# EAGLE design snowflake-r2 (EAGLE 5.12)
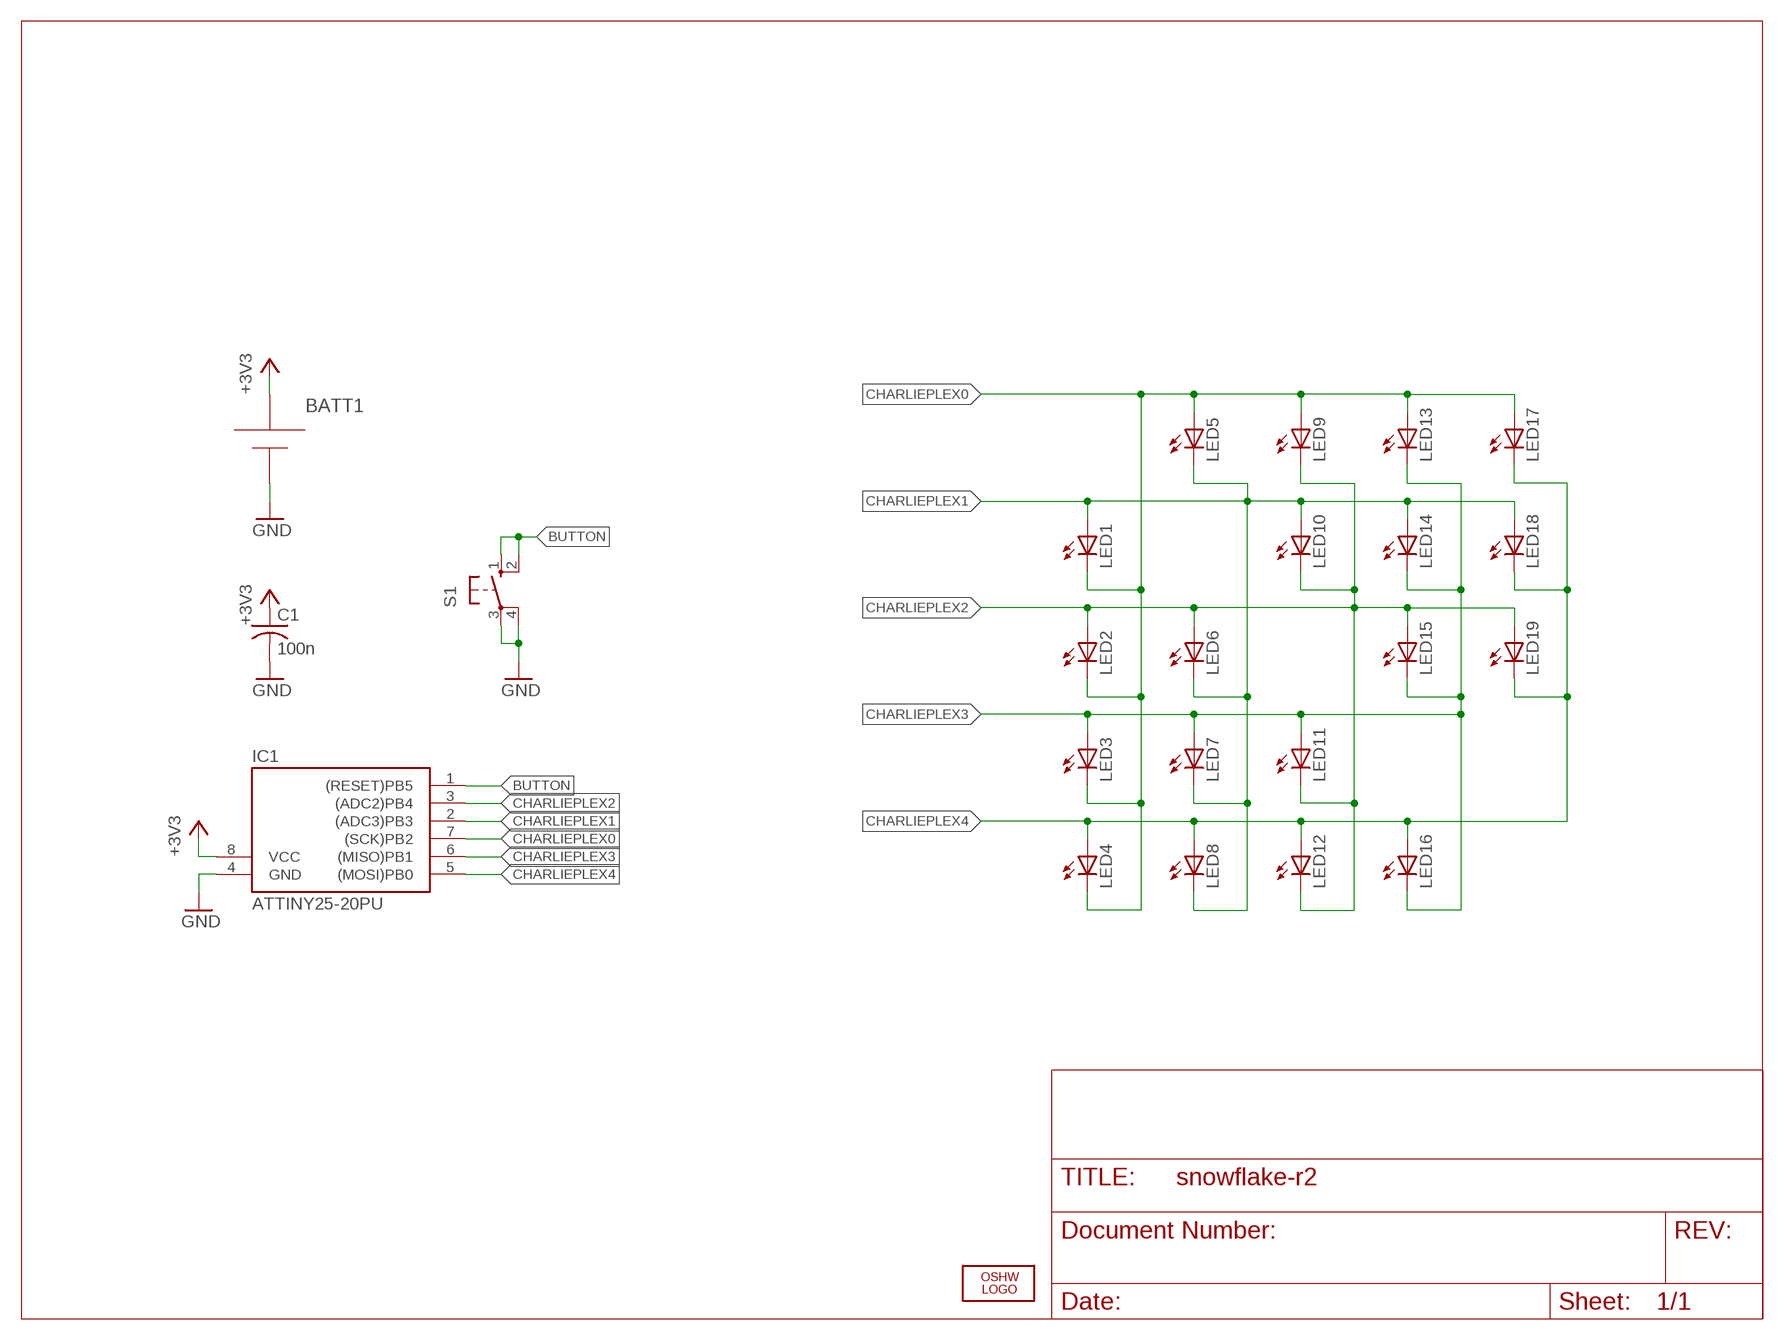
[diagram p0: schematic, sheet 1]

## Parts
BATT1  BC2AAAPC-CHINA  [BC2AAAPC-CHINA]
C1  100n  C-US050-025X075  [C050-025X075]
IC1  ATTINY25-20PU  TINY138P3  [DIL08]
LED1  LED3MM  [LED3MM]
LED2  LED3MM  [LED3MM]
LED3  LED3MM  [LED3MM]
LED4  LED3MM  [LED3MM]
LED5  LED3MM  [LED3MM]
LED6  LED3MM  [LED3MM]
LED7  LED3MM  [LED3MM]
LED8  LED3MM  [LED3MM]
LED9  LED3MM  [LED3MM]
LED10  LED3MM  [LED3MM]
LED11  LED3MM  [LED3MM]
LED12  LED3MM  [LED3MM]
LED13  LED3MM  [LED3MM]
LED14  LED3MM  [LED3MM]
LED15  LED3MM  [LED3MM]
LED16  LED3MM  [LED3MM]
LED17  LED3MM  [LED3MM]
LED18  LED3MM  [LED3MM]
LED19  LED3MM  [LED3MM]
LOGO1  OSHW_LOGO_FILLX0100-NT  [OSHW_FILLX100_NOTEXT]
S1  10-XX  [B3F-10XX]

## Nets
+3V3: BATT1.+ C1.1 IC1.8(VCC)
BUTTON: IC1.1((RESET)PB5) S1.1(S) S1.2(S1)
CHARLIEPLEX0: IC1.7((SCK)PB2) LED1.K(C) LED2.K(C) LED3.K(C) LED4.K(C) LED5.A LED9.A LED13.A LED17.A
CHARLIEPLEX1: IC1.2((ADC3)PB3) LED1.A LED5.K(C) LED6.K(C) LED7.K(C) LED8.K(C) LED10.A LED14.A LED18.A
CHARLIEPLEX2: IC1.3((ADC2)PB4) LED2.A LED6.A LED9.K(C) LED10.K(C) LED11.K(C) LED12.K(C) LED15.A LED19.A
CHARLIEPLEX3: IC1.6((MISO)PB1) LED3.A LED7.A LED11.A LED13.K(C) LED14.K(C) LED15.K(C) LED16.K(C)
CHARLIEPLEX4: IC1.5((MOSI)PB0) LED4.A LED8.A LED12.A LED16.A LED17.K(C) LED18.K(C) LED19.K(C)
GND: BATT1.- C1.2 IC1.4(GND) S1.3(P) S1.4(P1)

## Library data of the parts
BATT1 = rbg-mpd-battholder:BC2AAAPC-CHINA
C1 = rcl:C-US: CAPACITOR, American symbol
IC1 = avr-5:TINY13*
LED1-LED19 = led:LED: LED OSRAM: - CHIPLED LG R971, LG N971, LY N971, LG Q971, LY Q971, LO R971, LY R971 LH N974, LH R974 LS Q976, LO Q976, LY Q976 LO Q996 - Hyper CHIPLED LW Q18S LB Q993, LB Q99A, LB R99A - SideLED LS A670, LO A670, LY A670, LG A670, LP A670 LB A673, LV A673, LT A673, LW A673 LH A674 LY A675 LS A676, LA A676, LO A676, LY A676, LW A676 LS A679, LY A679, LG A679 - Hyper Micro SIDELED® LS Y876, LA Y876, LO Y876, LY Y876 LT Y87S - SmartLED LW L88C, LW L88S LB L89C, LB L89S, LG L890 LS L89K, LO L89K, LY L89K LS L896, LA L896, LO L896, LY L896 - TOPLED LS T670, LO T670, LY T670, LG T670, LP T670 LSG T670, LSP T670, LSY T670, LOP T670, LYG T670 LG T671, LOG T671, LSG T671 LB T673, LV T673, LT T673, LW T673 LH T674 LS T676, LA T676, LO T676, LY T676, LB T676, LH T676, LSB T676, LW T676 LB T67C, LV T67C, LT T67C, LS T67K, LO T67K, LY T67K, LW E67C LS E67B, LA E67B, LO E67B, LY E67B, LB E67C, LV E67C, LT E67C LW T67C LS T679, LY T679, LG T679 LS T770, LO T770, LY T770, LG T770, LP T770 LB T773, LV T773, LT T773, LW T773 LH T774 LS E675, LA E675, LY E675, LS T675 LS T776, LA T776, LO T776, LY T776, LB T776 LHGB T686 LT T68C, LB T68C - Hyper Mini TOPLED® LB M676 - Mini TOPLED Santana® LG M470 LS M47K, LO M47K, LY M47K Source: http://www.osram.convergy.de LUXEON: - LUMILED® LXK2-PW12-R00, LXK2-PW12-S00, LXK2-PW14-U00, LXK2-PW14-V00 LXK2-PM12-R00, LXK2-PM12-S00, LXK2-PM14-U00 LXK2-PE12-Q00, LXK2-PE12-R00, LXK2-PE12-S00, LXK2-PE14-T00, LXK2-PE14-U00 LXK2-PB12-K00, LXK2-PB12-L00, LXK2-PB12-M00, LXK2-PB14-N00, LXK2-PB14-P00, LXK2-PB14-Q00 LXK2-PR12-L00, LXK2-PR12-M00, LXK2-PR14-Q00, LXK2-PR14-R00 LXK2-PD12-Q00, LXK2-PD12-R00, LXK2-PD12-S00 LXK2-PH12-R00, LXK2-PH12-S00 LXK2-PL12-P00, LXK2-PL12-Q00, LXK2-PL12-R00 Source: www.luxeon.com KINGBRIGHT: KA-3528ASYC Source: www.kingbright.com
LOGO1 = ohw-logo:OSHW_LOGO_FILL
S1 = rbg-generic-tact-switch:10-XX: OMRON SWITCH

## Board
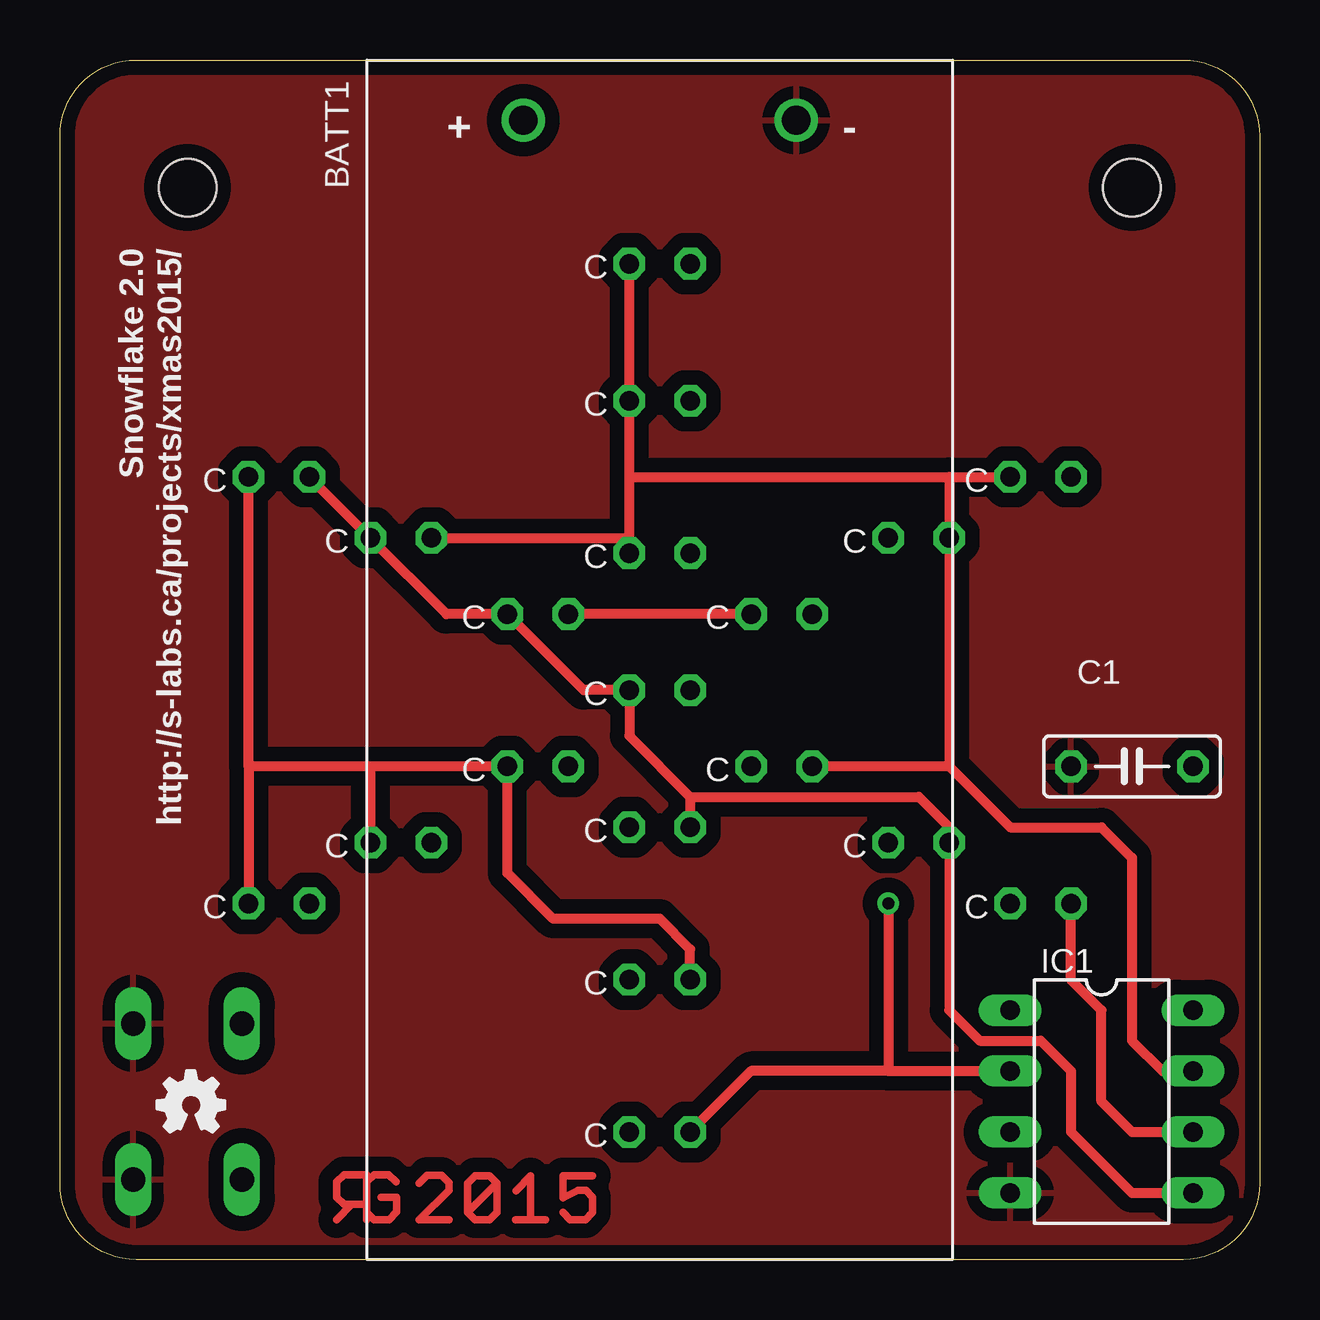
[diagram p1: board, top side]
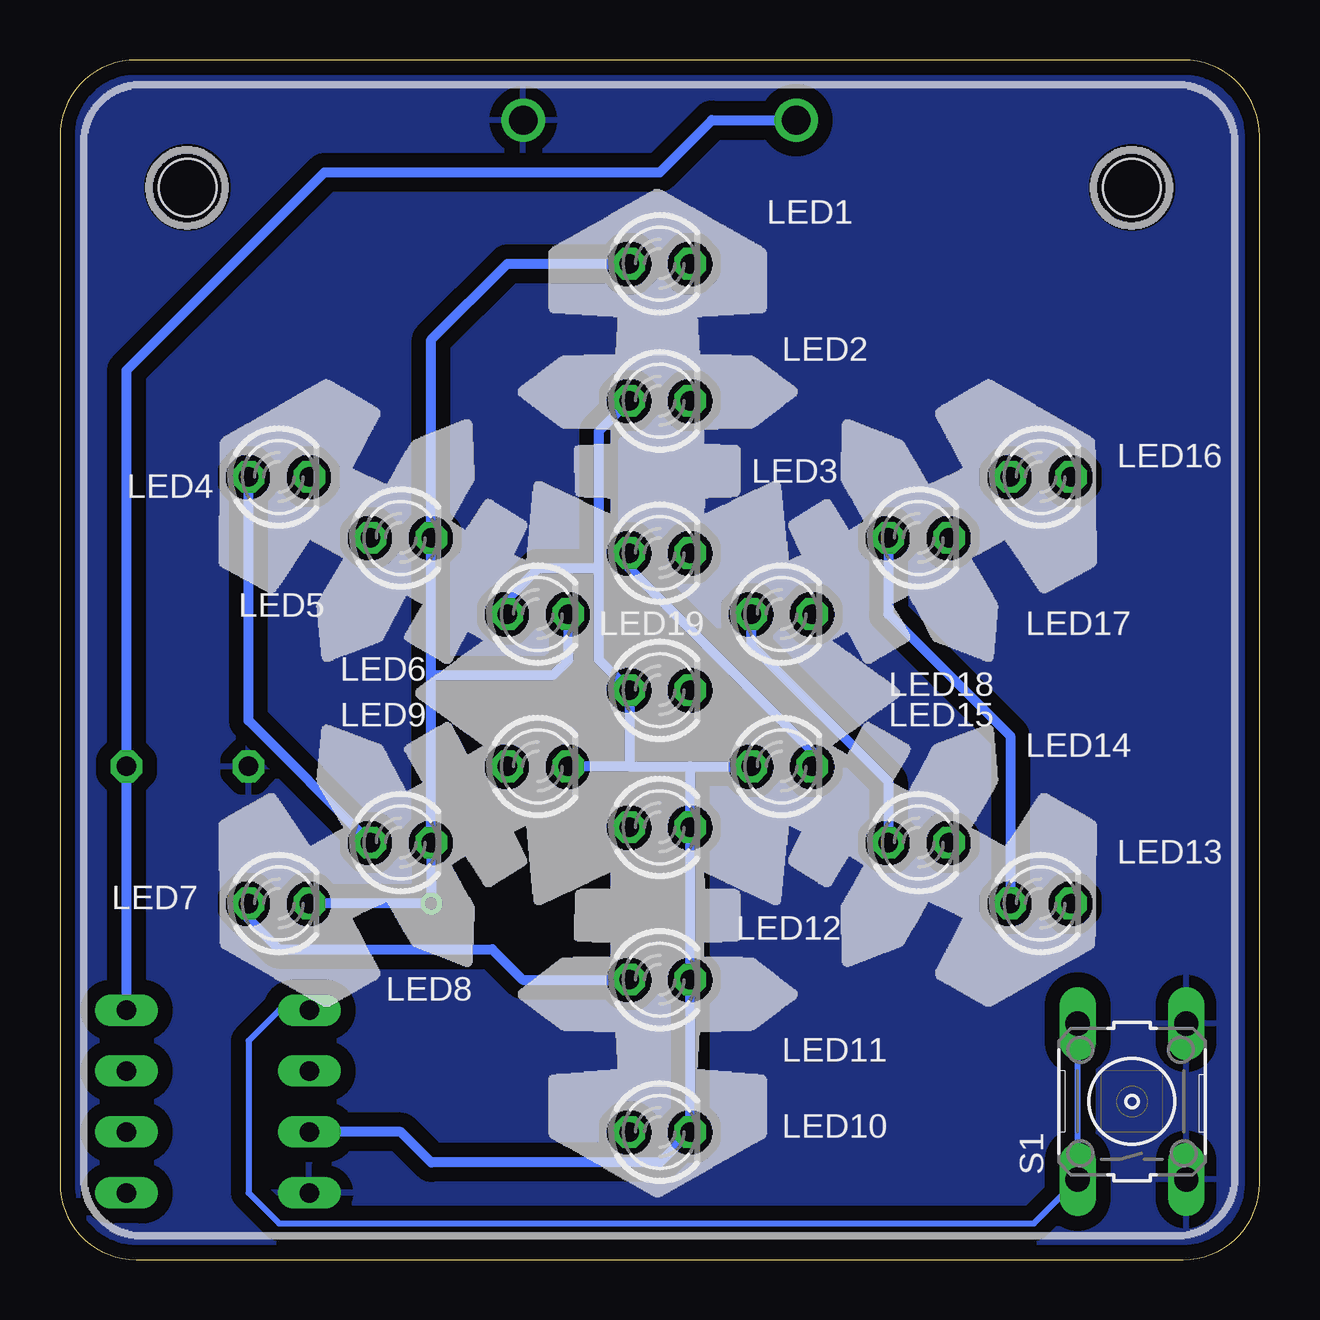
[diagram p2: board, bottom side, seen from below]

Size 50 x 50 mm. Coordinates in mm from the lower left corner, seen from the top.
Outline: 50,3.18 arc-90 46.83,0 3.18,0 arc-90 0,3.18 0,46.83 arc-90 3.18,50 46.83,50 arc-90 50,46.83 50,3.18
Copper layers (1*16): Top 0.035mm / dielectric 1.5mm / Bottom 0.035mm
Design rules "default *": minimum track width 10mil, minimum drill 0.5mm, track to track 8mil, track to pad 8mil, pad to pad 8mil, via to via 8mil, smd to smd 8mil, copper to edge 10mil, drill to drill 8mil, minimum pad ring 10mil, minimum via ring 8mil, stop-mask expansion 4mil, vias tented up to drill 20mil, thermal gap 20mil
Holes 2.4 mm at 44.69,44.69 5.32,44.69

### Footprints (pad centres in the part's own frame; a part is rotated, then mirrored left to right if it is on the bottom)
BC2AAAPC-CHINA = drill 1.2 round: + -22.49,-5.69; - -22.49,5.69
C050-025X075 = drill 0.813 octagon: 1 -2.54,0; 2 2.54,0
DIL08 = drill 0.813 long: 1 -3.81,-3.81; 2 -1.27,-3.81; 3 1.27,-3.81; 4 3.81,-3.81; 5 3.81,3.81; 6 1.27,3.81; 7 -1.27,3.81; 8 -3.81,3.81
LED3MM = drill 0.813 octagon: A -1.27,0; K 1.27,0
B3F-10XX = drill 1.016 long: 1 -3.251,2.261; 2 3.251,2.261; 3 -3.251,-2.261; 4 3.251,-2.261

### Placement (x,y rotation side)
BATT1  25,25 270 top
C1  44.69,20.55 180 top
IC1  43.41,6.59 270 top
LED1  25,41.51 0 bottom
LED2  25,35.8 0 bottom
LED3  25,29.45 0 bottom
LED4  40.88,32.62 0 bottom
LED5  35.8,30.08 0 bottom
LED6  30.08,26.91 0 bottom
LED7  40.88,14.84 0 bottom
LED8  35.8,17.38 0 bottom
LED9  30.08,20.55 0 bottom
LED10  25,5.32 0 bottom
LED11  25,11.66 0 bottom
LED12  25,18.02 0 bottom
LED13  9.12,14.84 0 bottom
LED14  14.21,17.38 0 bottom
LED15  19.92,20.55 0 bottom
LED16  9.12,32.62 0 bottom
LED17  14.21,30.08 0 bottom
LED18  19.92,26.91 0 bottom
LED19  25,23.73 0 bottom
LOGO1  4.05,5.32 0 top
S1  5.32,6.59 90 bottom
U$1  [SNOWFLAKE]  49.13,0.87 0 bottom
U$2  [RGLOGO_SMALL_2015]  12.94,1.5 0 top

### Tracks (layer width: path | path; a pad name or v marks a point on that pad's centre or on a via)
+3V3
  Bottom 0.406: IC1.8 C1.1 47.23,37.06 38.97,45.32 25,45.32 22.83,47.49 BATT1.+
BUTTON
  Bottom 0.254: S1.2 S1.1 9.4,1.5 40.88,1.5 42.14,2.77 42.14,9.12 40.88,10.39 IC1.1
CHARLIEPLEX0
  Top 0.406: LED1.K LED2.K 23.73,32.62 | 23.73,30.08 LED3.K | 23.73,30.08 23.73,32.62 | LED17.A 23.73,30.08 | 37.06,32.62 LED4.K | 23.73,32.62 37.06,32.62 | 37.06,32.62 LED5.A 37.06,20.55 | 37.06,20.55 39.61,18.02 43.41,18.02 44.69,16.74 44.69,9.12 45.95,7.86 IC1.7 | 37.06,20.55 LED9.A
  Bottom 0.406: LED13.A 10.39,21.82 15.47,26.91 LED17.A
CHARLIEPLEX1  (via drill 0.5)
  Top 0.406: 34.52,7.86 28.81,7.86 LED10.A | 34.52,7.86 IC1.2 | v34.52,14.84 34.52,7.86 | LED6.K LED18.A
  Bottom 0.406: LED7.K v34.52,14.84 LED8.K 34.52,24.36 | 34.52,24.36 LED5.K 34.52,38.34 31.35,41.51 LED1.A | LED6.K 28.81,25 29.45,24.36 34.52,24.36 | LED14.A 15.47,19.92 21.19,25.64 LED18.A
CHARLIEPLEX2
  Bottom 0.406: 26.27,20.55 23.73,20.55 | 26.27,20.55 LED9.K | 23.73,20.55 LED15.A | 23.73,20.55 LED12.K LED11.K LED10.K 25,4.05 34.52,4.05 35.8,5.32 IC1.3 | 26.27,20.55 LED19.A 27.54,25 27.54,28.81 | 27.54,28.81 27.54,34.52 LED2.A | LED6.A 31.35,27.54 30.08,28.81 27.54,28.81
CHARLIEPLEX3
  Top 0.406: 12.94,20.55 LED15.K 18.65,16.11 20.55,14.21 25,14.21 26.27,12.94 LED11.A | 12.94,20.55 7.86,20.55 | 7.86,20.55 LED13.K | 7.86,20.55 LED16.K | 12.94,20.55 LED14.K | IC1.6 44.69,5.32 43.41,6.59 43.41,10.39 42.14,11.66 LED7.A
  Bottom 0.406: LED3.A 26.27,28.81 18.65,21.19 LED15.K | LED11.A 30.71,11.66 31.98,12.94 40.88,12.94 42.14,14.21 LED7.A
CHARLIEPLEX4
  Top 0.406: LED16.A LED17.K 16.11,26.91 LED18.K 21.82,23.73 LED19.K 23.73,21.82 26.27,19.29 | 26.27,19.29 LED12.A | 26.27,19.29 35.8,19.29 37.06,18.02 LED8.A 37.06,10.39 38.34,9.12 40.88,9.12 42.14,7.86 42.14,5.32 44.69,2.77 IC1.5
  Bottom 0.406: LED4.A 42.14,22.46 LED8.A
GND
  pour Bottom (isolate 0.61): 51.03,51.03 -1.04,51.03 -1.04,-1.04 51.03,-1.04
  pour Top (isolate 0.61): 51.03,51.03 -1.04,51.03 -1.04,-1.04 51.03,-1.04

### Text on the board
tPlace: Snowflake 2.0 | http://s-labs.ca/projects/xmas2015/ | C | C | C | C | C | C | C | C | C | C | C | C | C | C | C | C | C | C | C